# EAGLE design Schematic_328programmer (EAGLE 7.6.0)
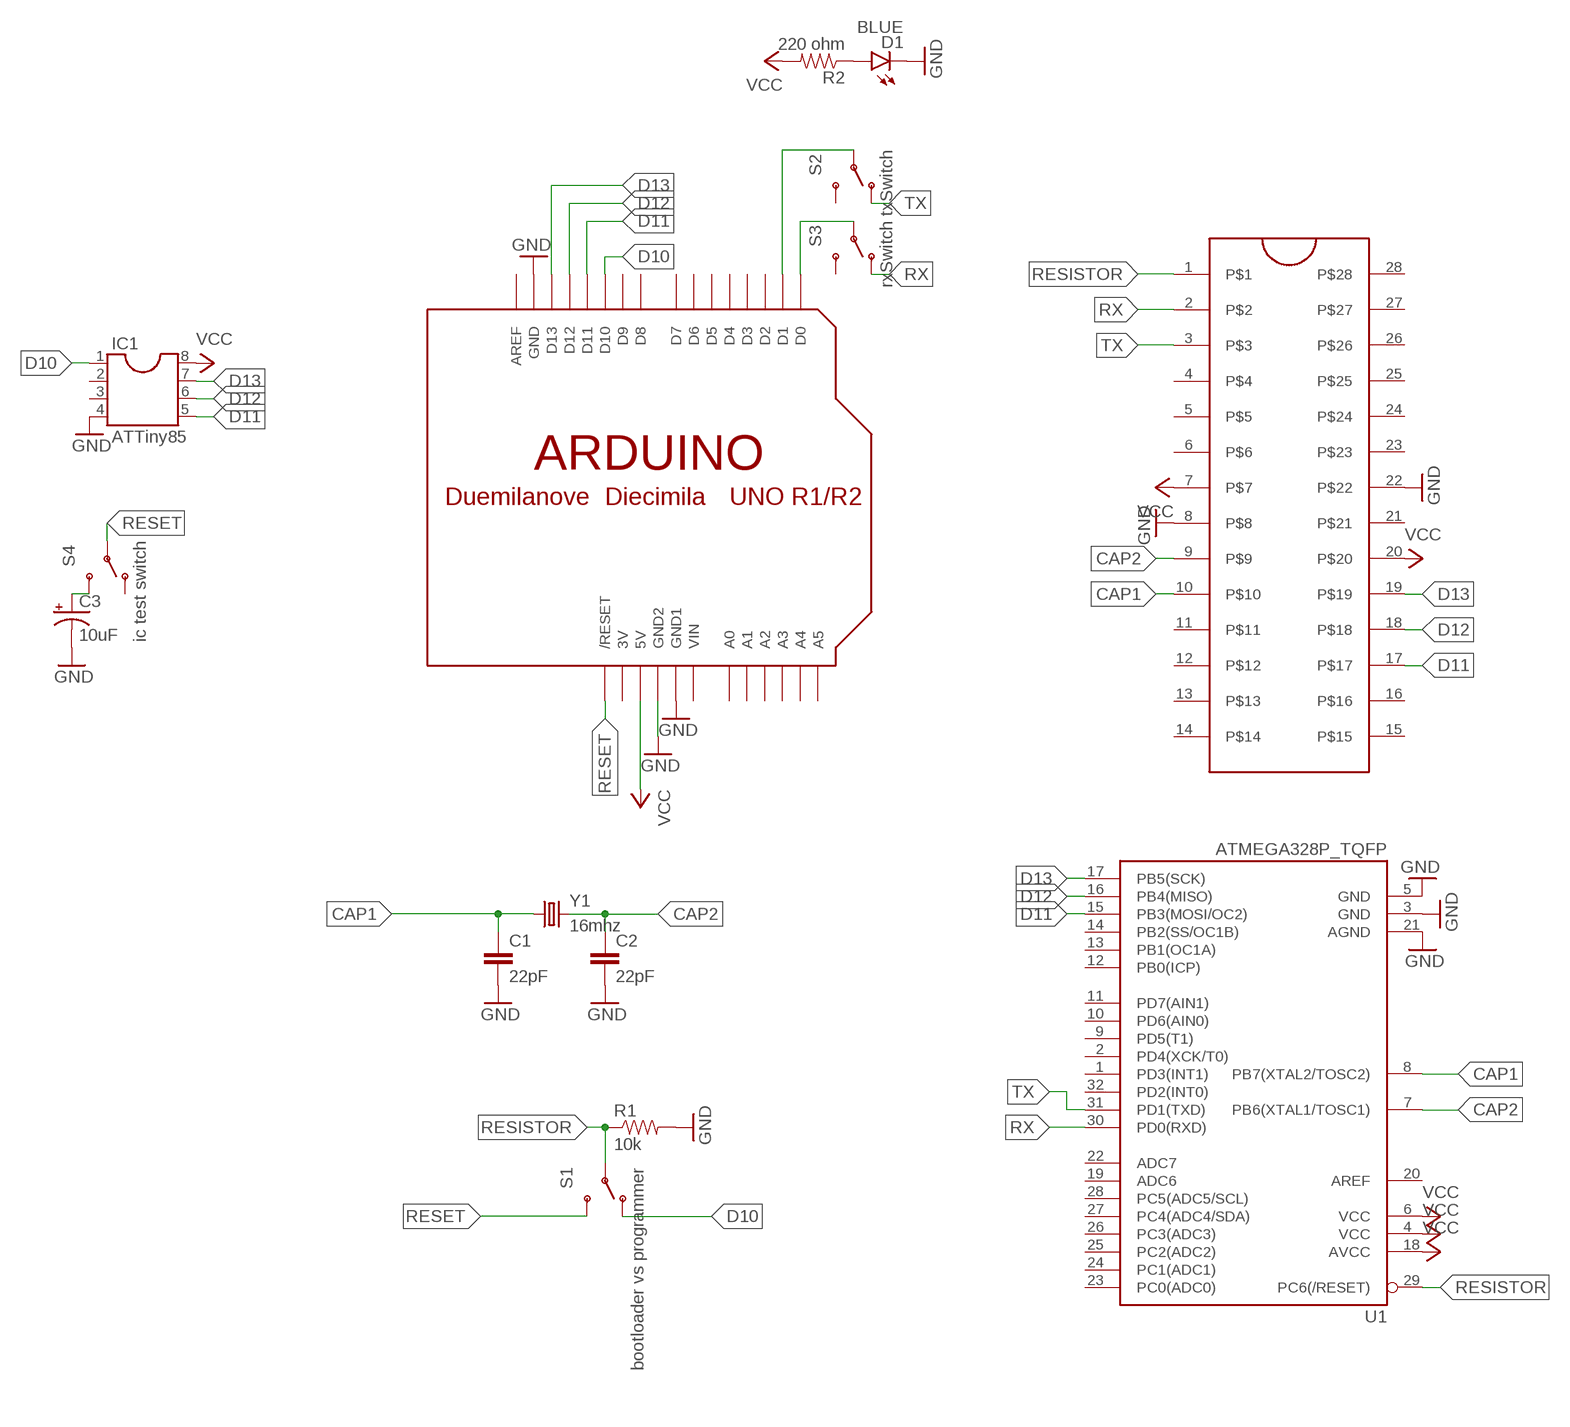
[diagram p0: schematic, sheet 1]

## Parts
C1  22pF  CAP0603-CAP  [0603-CAP]
C2  22pF  CAP0603-CAP  [0603-CAP]
C3  10uF  10UF-25V-20%(PTH)  [CPOL-RADIAL-10UF-25V]
D1  BLUE  LED-BLUE1206  [LED-1206]
IC1  ATTiny85  DIL8S  [SOCKET-08]
R1  10k  RESISTOR0603-RES  [0603-RES]
R2  220 ohm  RESISTOR0603  [0603-RES]
S1  bootloader vs programmer  SWITCH-SPDTPTH  [SWITCH-SPDT]
S2  txSwitch  SWITCH-SPDTPTH  [SWITCH-SPDT]
S3  rxSwitch  SWITCH-SPDTPTH  [SWITCH-SPDT]
S4  ic test switch  SWITCH-SPDTPTH  [SWITCH-SPDT]
U1  ATMEGA328P_TQFP  [TQFP32-08]
U$1  ARDUINO-NOHOLE  [ARDUINO-NOHOLE]
U$3  ZIFSOCKET-28-3ZIFFSOCKET-28-3  [DIL28-3-ZIF_SOCKET]
Y1  16mhz  CRYSTALHC49US  [HC49US]

## Nets
CAP1: C1.1 U1.8(PB7(XTAL2/TOSC2)) U$3.10 Y1.1
CAP2: C2.1 U1.7(PB6(XTAL1/TOSC1)) U$3.9 Y1.2
D10: IC1.1 S1.1(O) U$1.D10
D11: IC1.5 U1.15(PB3(MOSI/OC2)) U$1.D11 U$3.17
D12: IC1.6 U1.16(PB4(MISO)) U$1.D12 U$3.18
D13: IC1.7 U1.17(PB5(SCK)) U$1.D13 U$3.19
GND: C1.2 C2.2 C3.2(-) D1.C IC1.4 R1.2 U1.3(GND) U1.5(GND) U1.21(AGND) U$1.GND U$1.GND1 U$1.GND2 U$3.8 U$3.22
N$1: D1.A R2.1
N$2: S3.2(P) U$1.D0
N$3: S2.2(P) U$1.D1
N$5: C3.1(+) S4.3(S)
RESET: S1.3(S) S4.2(P) U$1.RESET(/RESET)
RESISTOR: R1.1 S1.2(P) U1.29(PC6(/RESET)) U$3.1
RX: S3.1(O) U1.30(PD0(RXD)) U$3.2
TX: S2.1(O) U1.31(PD1(TXD)) U$3.3
VCC: IC1.8 R2.2 U1.4(VCC) U1.6(VCC) U1.18(AVCC) U$1.5V U$3.7 U$3.20
Unconnected: IC1.2 IC1.3 S2.3(S) S3.3(S) S4.1(O) U1.1(PD3(INT1)) U1.2(PD4(XCK/T0)) U1.9(PD5(T1)) U1.10(PD6(AIN0)) U1.11(PD7(AIN1)) U1.12(PB0(ICP)) U1.13(PB1(OC1A)) U1.14(PB2(SS/OC1B)) U1.19(ADC6) U1.20(AREF) U1.22(ADC7) U1.23(PC0(ADC0)) U1.24(PC1(ADC1)) U1.25(PC2(ADC2)) U1.26(PC3(ADC3)) U1.27(PC4(ADC4/SDA)) U1.28(PC5(ADC5/SCL)) U1.32(PD2(INT0)) U$1.A0 U$1.A1 U$1.A2 U$1.A3 U$1.A4 U$1.A5 U$1.AREF U$1.D2 U$1.D3 U$1.D4 U$1.D5 U$1.D6 U$1.D7 U$1.D8 U$1.D9 U$3.4 U$3.5 U$3.6 U$3.11 U$3.12 U$3.13 U$3.14 U$3.15 U$3.16 U$3.21 U$3.23 U$3.24 U$3.25 U$3.26 U$3.27 U$3.28

## Power pins joined to a net without a drawn wire
3V: U$1.3V
VIN: U$1.VIN

## Library data of the parts
C1 C2 = SparkFun-Capacitors:CAP: Capacitor Standard 0603 ceramic capacitor, and 0.1" leaded capacitor.
C3 = SparkFun-Capacitors:10UF-25V-20%(PTH): CAP-08440; PROD_ID: CAP-08440
D1 = SparkFun-LED:LED-BLUE: Blue LEDs for production use Various blue LEDs stocked by SparkFun production 0603 - DIO-08575 Rebel - DIO-09553 1206 - DIO-09911; PROD_ID: DIO-09911
IC1 = ic-package:DIL8: Dual In Line / Socket
R1 = SparkFun-Passives:RESISTOR: Resistor Basic schematic elements and footprints for 0603, 1206, and PTH resistors.
R2 = SparkFun-Resistors:RESISTOR: Resistor Basic schematic elements and footprints for 0603, 1206, and PTH resistors.
S1-S4 = SparkFun-Electromechanical:SWITCH-SPDT: SPDT Switch Simple slide switch, Spark Fun Electronics SKU : COM-00102 DPDT SMT slide switch, AYZ0202, SWCH-08179; PROD_ID: SWCH-08261
U1 = SparkFun-DigitalIC:ATMEGA328P_TQFP; PROD_ID: IC-09069
U$1 = adafruit:ARDUINO: Arduino Diecimila/Duemilanove Make a shield with ease, this package has all the named pins as well as the two mounting drill holes and an outline of the USB and DC power connector. The outline is on the DIMENSION layer, so if your board house uses it they will cut the outline to match. http://www.ladyada.net/library/pcb/eaglelibrary.html
U$3 = SparkFun-Connectors:ZIFSOCKET-28-3: Lever-action ZIF socket for 28-pin ICs
Y1 = SparkFun-FreqCtrl:CRYSTAL: Various standard crystals. Proven footprints.

## Board
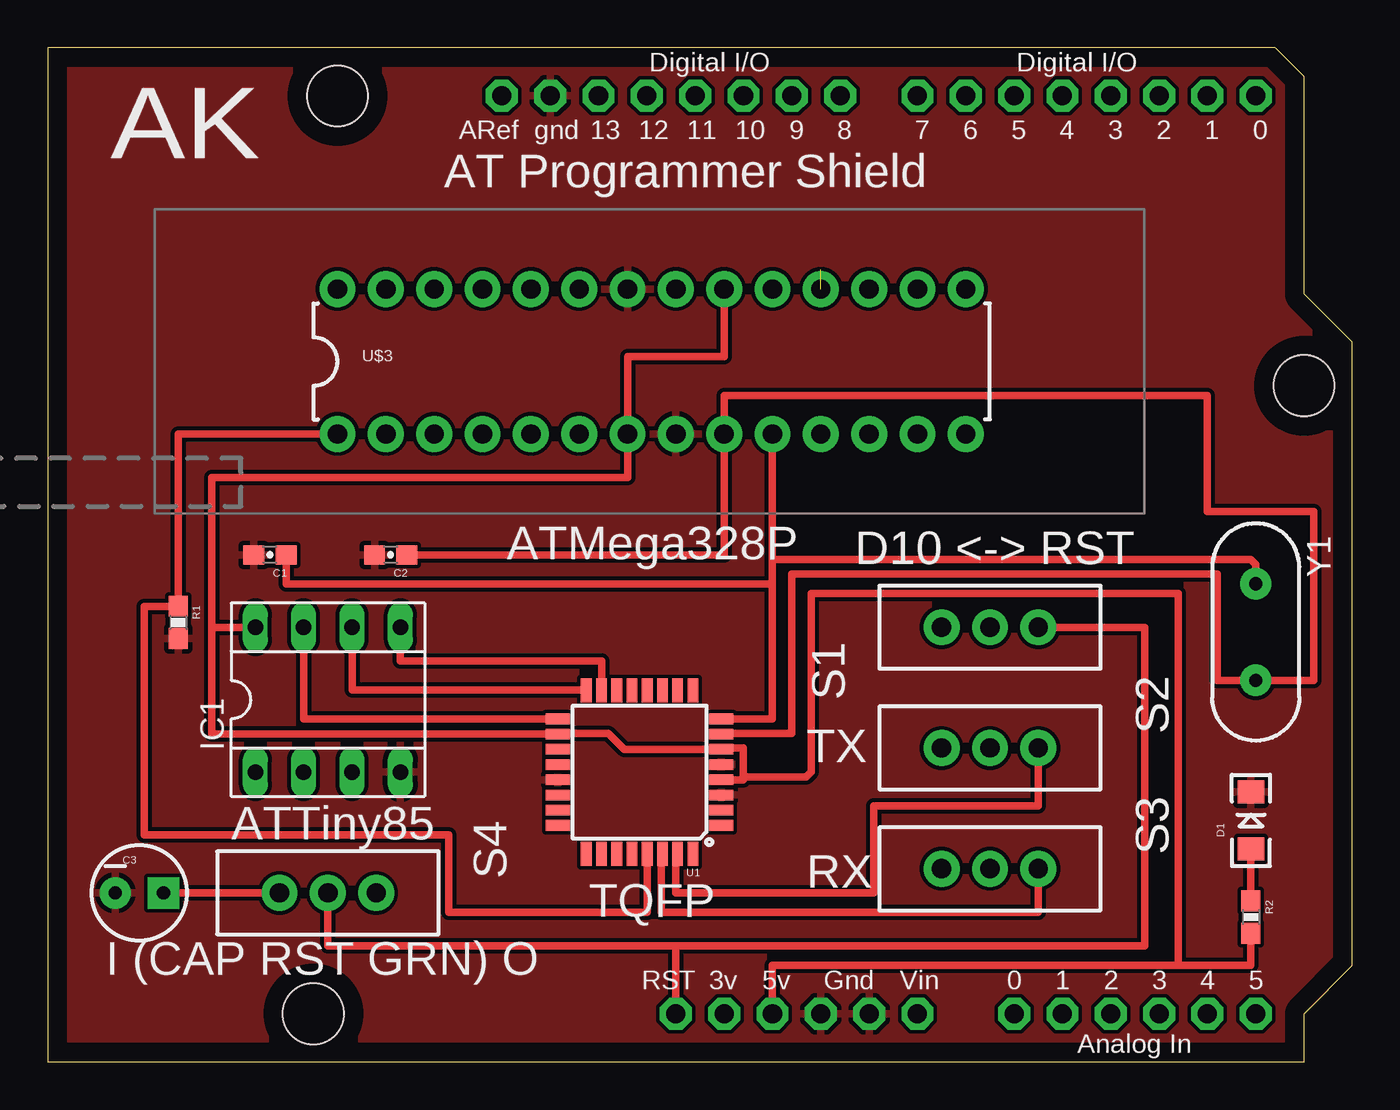
[diagram p1: board, top side]
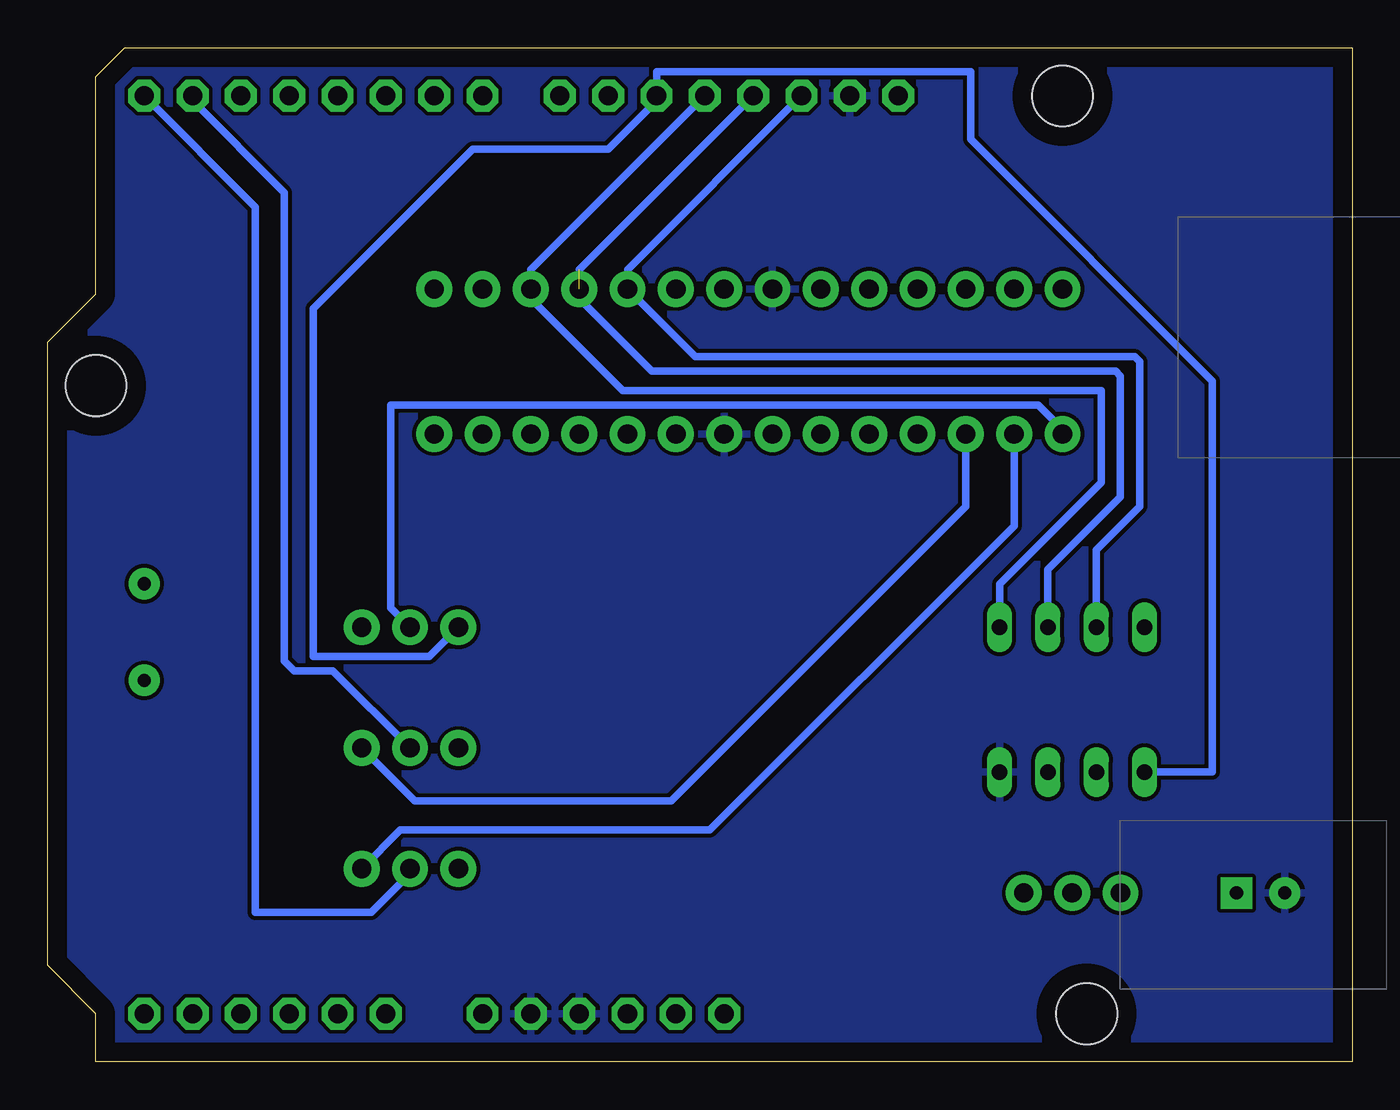
[diagram p2: board, bottom side, seen from below]

Size 68.58 x 53.34 mm. Coordinates in mm from the lower left corner, seen from the top.
Copper layers (1*16): Top 0.035mm / dielectric 1.5mm / Bottom 0.035mm
Design rules "default *": minimum track width 10mil, minimum drill 24mil, track to track 8mil, track to pad 8mil, pad to pad 8mil, via to via 8mil, smd to smd 8mil, copper to edge 40mil, drill to drill 8mil, minimum pad ring 10mil, minimum via ring 8mil, stop-mask expansion 4mil, vias tented up to drill 0mil, thermal gap 10mil

### Footprints (pad centres in the part's own frame; a part is rotated, then mirrored left to right if it is on the bottom)
0603-CAP = smd 1.1 x 1: 1 -0.85,0; 2 0.85,0
CPOL-RADIAL-10UF-25V = drill 0.7 pad 1.651 square: 1 1.27,0 | drill 0.7 pad 1.651: 2 -1.27,0
LED-1206 = smd 1.2 x 1.4: A -1.5,0; C 1.5,0
SOCKET-08 = drill 0.813 long: 1 -3.81,-3.81; 2 -1.27,-3.81; 3 1.27,-3.81; 4 3.81,-3.81; 5 3.81,3.81; 6 1.27,3.81; 7 -1.27,3.81; 8 -3.81,3.81
0603-RES = smd 1.1 x 1: 1 -0.85,0; 2 0.85,0
SWITCH-SPDT = drill 1.016 pad 1.88: 1 0,2.54; 2 0,0; 3 0,-2.54
TQFP32-08 = smd 1.27 x 0.559: 1 -4.293,2.8; 2 -4.293,2; 3 -4.293,1.2; 4 -4.293,0.4; 5 -4.293,-0.4; 6 -4.293,-1.2; 7 -4.293,-2; 8 -4.293,-2.8; 17 4.293,-2.8; 18 4.293,-2; 19 4.293,-1.2; 20 4.293,-0.4; 21 4.293,0.4; 22 4.293,1.2; 23 4.293,2; 24 4.293,2.8 | smd 0.559 x 1.27: 9 -2.8,-4.293; 10 -2,-4.293; 11 -1.2,-4.293; 12 -0.4,-4.293; 13 0.4,-4.293; 14 1.2,-4.293; 15 2,-4.293; 16 2.8,-4.293; 25 2.8,4.293; 26 2,4.293; 27 1.2,4.293; 28 0.4,4.293; 29 -0.4,4.293; 30 -1.2,4.293; 31 -2,4.293; 32 -2.8,4.293
ARDUINO = drill 1 pad 1.676 octagon: 3V 35.56,2.54; 5V 38.1,2.54; A0 50.8,2.54; A1 53.34,2.54; A2 55.88,2.54; A3 58.42,2.54; A4 60.96,2.54; A5 63.5,2.54; AREF 23.876,50.8; D0 63.5,50.8; D1 60.96,50.8; D2 58.42,50.8; D3 55.88,50.8; D4 53.34,50.8; D5 50.8,50.8; D6 48.26,50.8; D7 45.72,50.8; D8 41.656,50.8; D9 39.116,50.8; D10 36.576,50.8; D11 34.036,50.8; D12 31.496,50.8; D13 28.956,50.8; GND 26.416,50.8; GND1 43.18,2.54; GND2 40.64,2.54; RESET 33.02,2.54; VIN 45.72,2.54 | hole 3.2: 15.24,50.8; 66.04,35.56; 13.97,2.54
DIL28-3-ZIF_SOCKET = drill 1.016 pad 1.88: 1 -16.51,-3.81; 2 -13.97,-3.81; 3 -11.43,-3.81; 4 -8.89,-3.81; 5 -6.35,-3.81; 6 -3.81,-3.81; 7 -1.27,-3.81; 8 1.27,-3.81; 9 3.81,-3.81; 10 6.35,-3.81; 11 8.89,-3.81; 12 11.43,-3.81; 13 13.97,-3.81; 14 16.51,-3.81; 15 16.51,3.81; 16 13.97,3.81; 17 11.43,3.81; 18 8.89,3.81; 19 6.35,3.81; 20 3.81,3.81; 21 1.27,3.81; 22 -1.27,3.81; 23 -3.81,3.81; 24 -6.35,3.81; 25 -8.89,3.81; 26 -11.43,3.81; 27 -13.97,3.81; 28 -16.51,3.81
HC49US = drill 0.7 pad 1.651: 1 -2.54,0; 2 2.54,0

### Placement (x,y rotation side)
C1  11.68,26.67 180 top
C2  18.03,26.67 180 top
C3  4.83,8.89 0 top
D1  63.25,12.7 90 top
IC1  14.73,19.05 0 top
R1  6.86,23.11 270 top
R2  63.25,7.62 270 top
S1  49.53,22.86 90 top
S2  49.53,16.51 270 top
S3  49.53,10.16 270 top
S4  14.73,8.89 270 top
U1  31.12,15.24 180 top
U$1  ARDUINOUNO  [ARDUINO]  0,0 0 top
U$3  31.75,36.83 0 top
Y1  63.5,22.61 270 top

### Tracks (layer width: path | path; a pad name or v marks a point on that pad's centre or on a via)
CAP1
  Top 0.406: Y1.1 63.5,26.16 63.25,26.42 38.1,26.42 | 38.1,26.42 U$3.10 | 38.1,26.42 38.1,25.15 | 38.1,25.15 38.1,18.04 U1.8 | C1.1 12.53,25.15 38.1,25.15
CAP2
  Top 0.406: U1.7 35.41,17.27 39.12,17.27 39.12,25.65 61.47,25.65 61.47,20.07 Y1.2 66.55,20.07 66.55,28.96 60.96,28.96 60.96,35.05 35.56,35.05 U$3.9 35.56,26.67 C2.1
D10
  Bottom 0.406: IC1.1 7.37,15.24 7.37,35.81 20.07,48.51 20.07,52.07 36.58,52.07 U$1.D10 36.58,50.55 39.12,48.01 46.23,48.01 54.61,39.62 54.61,21.34 48.51,21.34 S1.1
D11
  Top 0.406: IC1.5 18.54,21.08 29.12,21.08 U1.15
  Bottom 0.406: U$1.D11 43.18,41.66 U$3.17 43.18,40.13 38.35,35.31 13.21,35.31 13.21,30.48 18.54,25.15 IC1.5
D12  (1 unrouted)
  Top 0.406: U1.16 28.31,19.56 16,19.56 IC1.6
  Bottom 0.406: IC1.6 16,25.91 12.19,29.72 12.19,36.07 12.45,36.32 36.83,36.32 40.64,40.13 U$3.18 | U$1.D12 40.64,41.66
D13
  Top 0.406: IC1.7 13.46,18.03 U1.17
  Bottom 0.406: IC1.7 13.46,26.92 11.18,29.21 11.18,36.83 11.43,37.08 34.54,37.08 U$3.19 38.1,41.66 U$1.D13
GND
  pour Bottom: -10.16,80.01 -10.16,-5.08 96.52,-5.08 96.52,80.01
  pour Top: -11.43,81.28 -11.43,-3.81 97.79,-3.81 97.79,-2.54 97.79,82.55 -11.43,82.55
N$1
  Top 0.406: R2.1 D1.A
N$2
  Bottom 0.406: U$1.D0 57.66,44.96 57.66,7.87 51.56,7.87 49.53,9.91 S3.2
N$3
  Bottom 0.406: S2.2 53.59,20.57 55.63,20.57 56.13,21.08 56.13,45.72 60.96,50.55 U$1.D1
N$5
  Top 0.406: C3.1 S4.3
RESET
  Top 0.406: S4.2 14.73,6.1 33.02,6.1 | 33.02,6.1 57.66,6.1 57.66,22.86 S1.3 | U$1.RESET 33.02,6.1
RESISTOR
  Top 0.406: U$3.1 6.86,33.02 6.86,24.3 6.69,24.13 R1.1 5.08,23.96 5.08,11.94 21.08,11.94 21.08,7.87 31.52,7.87 U1.29
  Bottom 0.406: S1.2 50.55,23.88 50.55,34.54 16.51,34.54 15.24,33.27 U$3.1
RX
  Top 0.406: U1.30 32.26,10.95 32.26,7.87 32.77,7.87 52.07,7.87 S3.1
  Bottom 0.406: U$3.2 17.78,28.19 33.78,12.19 50.04,12.19 S3.1
TX
  Top 0.406: U1.31 33.02,10.95 33.02,8.89 43.43,8.89 43.43,13.46 52.07,13.46 S2.1
  Bottom 0.406: U$3.3 20.32,29.21 35.81,13.72 49.28,13.72 S2.1
VCC
  Top 0.406: U$1.5V 38.1,5.08 59.44,5.08 | 59.44,5.08 59.44,24.64 40.13,24.64 40.13,15.24 39.88,14.99 36.58,14.99 | 8.64,22.86 8.64,30.73 30.48,30.73 U$3.7 30.48,37.08 35.56,37.08 U$3.20 | 8.64,22.86 8.64,17.24 U1.18 26.85,17.27 29.46,17.27 30.3,16.44 U1.6 35.48,16.51 36.58,16.51 36.58,14.99 | 59.44,5.08 63.25,5.08 R2.2 | IC1.8 8.64,22.86 | 36.58,14.99 36.58,14.84 U1.4

### Text on the board
tPlace: AK | AT Programmer Shield | ATMega328P | D10 <-> RST | TX | ATTiny85 | RX | TQFP | I (CAP RST GRN) O